# Altium schematic sheet 1_P1.schdoc
size 431 x 309 mm; Symbol: Sheet-Symbol_A4; Device: Sheet-Symbol_A4; @Page Name: P1; @Create Date: 2023-05-10; @Page Count: 1; @Page No: 1; @Project Name: 大创第一版1; @Schematic Name: 大创第一版; @Update Date: 2023-07-12; Company: 重庆邮电大学; Drawed: 陈亦杨; Page Size: A4; Reviewed: 2021212923陈亦杨; Version: V1.1
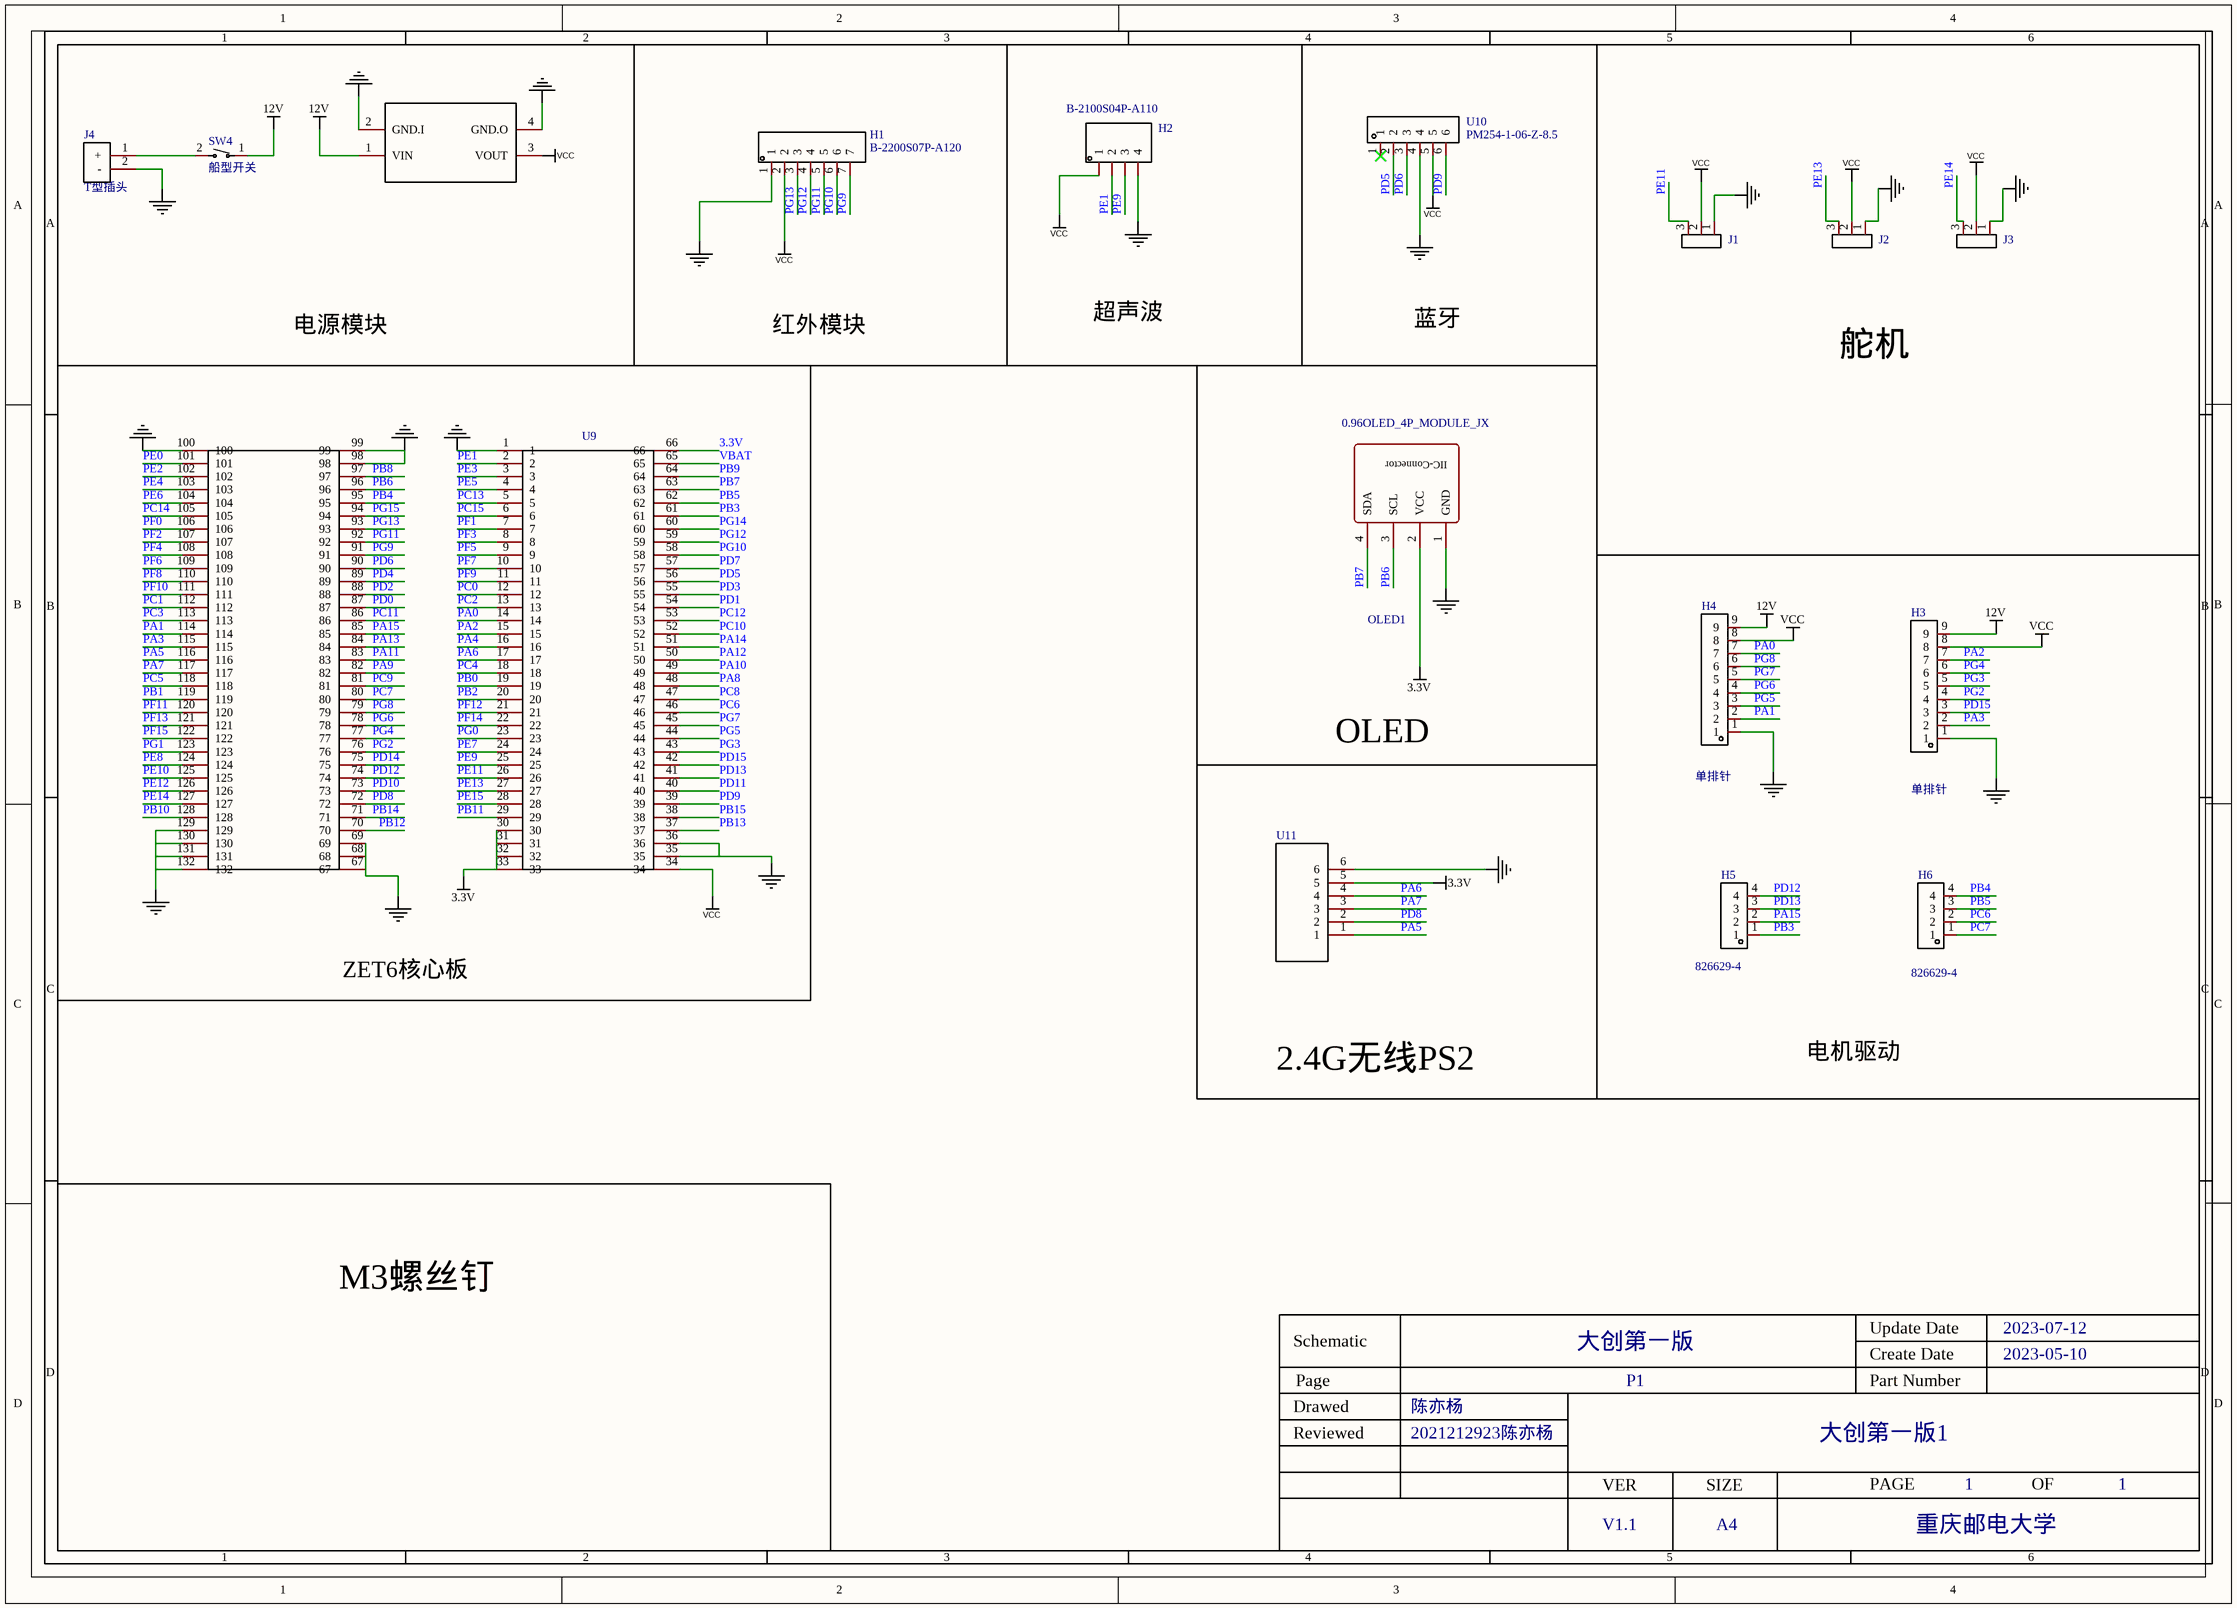
[diagram p0: 1_P1.schdoc]

## Parts
H1  B-2200S07P-A120  [HDR-TH_7P-P2.54-V-F]
H2  B-2100S04P-A110  [HDR-TH_4P-P2.54-V-M]
H3  单排针  [排针2.54MM9P]
H4  单排针  [排针2.54MM9P]
H5  826629-4  [HDR-TH_4P-P2.54-V-M-1]
H6  826629-4  [HDR-TH_4P-P2.54-V-M-1]
J1  3排针  [3排针]  (value not drawn)
J2  3排针  [3排针]  (value not drawn)
J3  3排针  [3排针]  (value not drawn)
J4  T型插头  [T型插头]
OLED1  0.96OLED_4P_MODULE_JX  [0.96OLED_4P]
SW4  船型开关  [SW-TH_MR1-110-C5N-BBAA]
U6  LM2596  [LM2596]  (value not drawn)
U9  ZET6核心板  [ZET6封装-2]  (value not drawn)
U10  PM254-1-06-Z-8.5  [HDR-TH_6P-P2.54-V-F]
U11  排针1*6  [排针1*6p]  (value not drawn)

## Nets
3.3V: OLED1.2(VCC) U9.30 U9.31 U9.32 U9.33 U9.66 U11.5
12V: H3.9 H4.9 SW4.1 U6.1(VIN)
GND: H1.1 H2.4 H3.1 H4.1 J1.1 J2.1 J3.1 J4.2(-) OLED1.1(GND) U6.2(GND.I) U6.4(GND.O) U9.1 U9.98 U9.99 U9.100 U10.4
NetU9_35: U9.35 U9.36 U9.67 U9.68 U9.69 U9.129 U9.130 U9.131 U9.132 U11.6
VCC: H1.2 H2.1 H3.8 H4.8 J1.2 J2.2 J3.2 U6.3(VOUT) U9.34 U10.5
PA0: H4.7 U9.14
PA1: H4.2 U9.114
PA2: H3.7 U9.15
PA3: H3.2 U9.115
PA4: U9.16
PA5: U9.116 U11.1
PA6: U9.17 U11.4
PA7: U9.117 U11.3
PA8: U9.48
PA9: U9.82
PA10: U9.49
PA11: U9.83
PA12: U9.50
PA13: U9.84
PA14: U9.51
PA15: H5.2 U9.85
PB0: U9.19
PB1: U9.119
PB2: U9.20
PB3: H5.1 U9.61
PB4: H6.4 U9.95
PB5: H6.3 U9.62
PB6: OLED1.3(SCL) U9.96
PB7: OLED1.4(SDA) U9.63
PB8: U9.97
PB9: U9.64
PB10: U9.128
PB11: U9.29
PB12: U9.70
PB13: U9.37
PB14: U9.71
PB15: U9.38
PC0: U9.12
PC1: U9.112
PC2: U9.13
PC3: U9.113
PC4: U9.18
PC5: U9.118
PC6: H6.2 U9.46
PC7: H6.1 U9.80
PC8: U9.47
PC9: U9.81
PC10: U9.52
PC11: U9.86
PC12: U9.53
PC13: U9.5
PC14: U9.105
PC15: U9.6
PD0: U9.87
PD1: U9.54
PD2: U9.88
PD3: U9.55
PD4: U9.89
PD5: U9.56 U10.2
PD6: U9.90 U10.3
PD7: U9.57
PD8: U9.72 U11.2
PD9: U9.39 U10.6
PD10: U9.73
PD11: U9.40
PD12: H5.4 U9.74
PD13: H5.3 U9.41
PD14: U9.75
PD15: H3.3 U9.42
PE0: U9.101
PE1: H2.2 U9.2
PE2: U9.102
PE3: U9.3
PE4: U9.103
PE5: U9.4
PE6: U9.104
PE7: U9.24
PE8: U9.124
PE9: H2.3 U9.25
PE10: U9.125
PE11: J1.3 U9.26
PE12: U9.126
PE13: J2.3 U9.27
PE14: J3.3 U9.127
PE15: U9.28
PF0: U9.106
PF1: U9.7
PF2: U9.107
PF3: U9.8
PF4: U9.108
PF5: U9.9
PF6: U9.109
PF7: U9.10
PF8: U9.110
PF9: U9.11
PF10: U9.111
PF11: U9.120
PF12: U9.21
PF13: U9.121
PF14: U9.22
PF15: U9.122
PG0: U9.23
PG1: U9.123
PG2: H3.4 U9.76
PG3: H3.5 U9.43
PG4: H3.6 U9.77
PG5: H4.3 U9.44
PG6: H4.4 U9.78
PG7: H4.5 U9.45
PG8: H4.6 U9.79
PG9: H1.7 U9.91
PG10: H1.6 U9.58
PG11: H1.5 U9.92
PG12: H1.4 U9.59
PG13: H1.3 U9.93
PG14: U9.60
PG15: U9.94
VBAT: U9.65
NetJ4_1: J4.1(+) SW4.2

Not connected (* = marked no-connect by the designer): U10 1*

## Notes on the sheet
- 超声波
- 电源模块
- 红外模块
- 蓝牙
- 舵机
- OLED
- ZET6核心板
- 2.4G无线PS2
- 电机驱动
- M3螺丝钉
- 1
- 2
- 3
- 4
- 5
- 6
- A
- B
- C
- D
- Schematic
- 大创第一版
- Create Date
- Update Date
- 2023-05-10
- 2023-07-12
- Reviewed
- Drawed
- Page
- 陈亦杨
- 2021212923陈亦杨
- P1
- Part Number
- 大创第一版1
- VER
- SIZE
- PAGE
- OF
- V1.1
- A4
- 重庆邮电大学
- (in symbol 0.96OLED_4P_MODULE_JX) IIC-Connector

## Library data of the parts
H1 = B-2200S07P-A120: 排数:单排;总孔位数:7;间距:2.54mm;插孔结构:1x7P;行距:-;安装类型:直插;塑高:-;触头材质:黄铜;触头镀层:-;; Manufacturer: Ckmtw(灿科盟); Symbol: 220S-1*7P H=8.5MM Ytype Gold-plated; Add into BOM: yes; Number of Holes: 7; Pitch: 2.54mm; Holes Structure: 1x7P; Name: B-2200S07P-A120; Device: B-2200S07P-A120; LCSC Part Name: 2.54mm1x7P; Supplier Part: C124418; Manufacturer Part: B-2200S07P-A120; Supplier Footprint: 直插,P=2.54mm; JLCPCB Part Class: ExtendedPart; Datasheet: https://atta.szlcsc.com/upload/public/pdf/source/20170821/C124418_1503303326113901572.pdf; Supplier: LCSC; Convert to PCB: yes; Number of Rows: 单排; Row Spacing: -; Mounting Type: 直插; Insulation Height: -; Contact Material: 黄铜; Contact Plating: -
H2 = B-2100S04P-A110: 排数:单排;总PIN位数:4;间距:2.54mm;插针结构:1x4P;行距:-;安装类型:直插;圆针/方针:-;额定电流:-;额定电压:-;配合针长度:6mm;塑高:2.54mm;端接针长度:3mm;触头材质:黄铜;触头镀层:-;工作温度范围:-40℃~+105℃;颜色:黑色;; Manufacturer: Ckmtw(灿科盟); Symbol: Header-Male-2.54_1x4; Add into BOM: yes; Pitch: 2.54mm; Pin Structure: 1x4P; Name: B-2100S04P-A110; Device: B-2100S04P-A110; LCSC Part Name: 2.54mm1x4P直插; Supplier Part: C124378; Manufacturer Part: B-2100S04P-A110; Supplier Footprint: 插件,P=2.54mm; JLCPCB Part Class: ExtendedPart; Datasheet: https://atta.szlcsc.com/upload/public/pdf/source/20170821/C124378_1503303307508901532.pdf; Supplier: LCSC; Convert to PCB: yes; Number of Rows: 单排; Number of Pins: 4; Row Spacing: -; Mounting Type: 直插; Circluar Pins/Square Pins: -; Current Rating (Max): -; Voltage Rating (Max): -; Length of Mating Pin: 6mm; Insulation Height: 2.54mm; Length of End Connection Pin: 3mm; Contact Material: 黄铜; Contact Plating: -; Operating Temperature Range: -40℃~+105℃; Color: 黑色
H3 H4 = 排针9P-2.54MM直插: Add into BOM: yes; Value: 0.0225; Name: 单排针; Symbol: 排针9P-2.54MM直插; Device: 排针9P-2.54MM直插; Supplier: 吉友; Convert to PCB: yes; Price: 0.045
H5 H6 = 排针2: 排数:单排;总PIN位数:4;间距:2.54mm;插针结构:1x4P;行距:-;安装类型:直插;圆针/方针:-;额定电流:-;额定电压:-;配合针长度:6.7mm;塑高:2.8mm;端接针长度:3.2mm;触头材质:-;工作温度范围:-;颜色:绿色;; Manufacturer: TE Connectivity(美国泰科); Add into BOM: yes; Pitch: 2.54mm; Pin Structure: 1x4P; Name: 826629-4; Symbol: 排针2; Device: 排针2; Convert to PCB: yes; LCSC Part Name: 2.54mm 1x4P 直插; Supplier Part: C590277; Manufacturer Part: 826629-4; Supplier Footprint: 插件,P=2.54mm; JLCPCB Part Class: 扩展库; Datasheet: https://atta.szlcsc.com/upload/public/pdf/source/20210923/FCC8CD9A04BA2624CF68C067B4A5B53A.pdf; Supplier: LCSC; Number of Rows: 单排; Number of Pins: 4; Row Spacing: -; Mounting Type: 直插; Circluar Pins/Square Pins: -; Current Rating (Max): -; Voltage Rating (Max): -; Length of Mating Pin: 6.7mm; Insulation Height: 2.8mm; Length of End Connection Pin: 3.2mm; Contact Material: -; Operating Temperature Range: -; Color: 绿色
J1-J3 = 3排针: Add into BOM: yes; Symbol: 3排针; Device: 3排针; Convert to PCB: yes
J4 = T型插头: Add into BOM: yes; _: 3; Name: T型插头; Symbol: T型插头; Device: T型插头; Convert to PCB: yes; Supplier: 逐飞科技
OLED1 = 0.96OLED_4P_MODULE_JX: Manufacturer: null; Add into BOM: yes; Name: 0.96OLED_4P_MODULE_JX; Symbol: 0.96OLED_4P_MODULE_JX; Device: 0.96OLED_4P_MODULE_JX; Convert to PCB: yes; 3DModel: 0.96OLED_4P; link: https://cn.bing.com/search?q=datasheet：0.96OLED; Supplier: LCSC; Supplier Part: C9900004566; Manufacturer Part: 0.96OLED_4P_MODULE_JX; JLCPCB Part Class: 扩展库
SW4 = MR1-110-C5N-BBAA: 额定电流:6A;额定电压(AC):250V;额定电压(DC):-;电路结构:单刀双掷;致动器类型:凹面弯曲;致动器颜色:黑色;致动器标志:O-;照明颜色:-;端接样式:焊片;开关功能:开-关;; Manufacturer: HONGJU(宏聚); Add into BOM: yes; Contact Current: 6A; Voltage Rating (AC): 250V; Circuit: 单刀双掷; Actuator Type: 凹面弯曲; Actuator Color: 黑色; Actuator Marking: O-; Switch Function: 开-关; Name: 船型开关; Symbol: MR1-110-C5N-BBAA; Device: MR1-110-C5N-BBAA; LCSC Part Name: 21*15开关ON-OFF6A250VAC; Supplier Part: C268221; Manufacturer Part: 船型开关; Supplier Footprint: ThroughHole; JLCPCB Part Class: ExtendedPart; Datasheet: https://atta.szlcsc.com/upload/public/pdf/source/20180906/C268221_8C71464C7CB1239118C227B6F3D265B4.pdf; Supplier: LCSC; Convert to PCB: yes; Voltage Rating (DC): -; Illumination Color: -; Termination Style: 焊片
U6 = LM2596: Add into BOM: yes; _: 3; Name: LM2596; Symbol: LM2596; Device: LM2596; Convert to PCB: yes
U9 = ZET6核心板: F103ZET6核心板; Symbol: ZET6; Convert to PCB: yes; Device: ZET6核心板; Add into BOM: yes
U10 = PM254-1-06-Z-8.5: 排数:单排;总孔位数:6;间距:2.54mm;插孔结构:1x6P;行距:-;安装类型:直插;圆孔/方孔:方孔;额定电流:3A;额定电压:-;插孔方向:顶部;塑高:8.5mm;工作温度范围:-40℃~+105℃;; Manufacturer: HCTL(华灿天禄); Add into BOM: yes; Number of Holes: 6; Pitch: 2.54mm; Holes Structure: 1x6P; Circular Hole / Square Hole: 方孔; Current Rating (Max): 3A; Holes Direction: 顶部; Name: PM254-1-06-Z-8.5; Symbol: PM254-1-06-Z-8.5; Device: PM254-1-06-Z-8.5; LCSC Part Name: 2.54mm1x6P; Supplier Part: C2897369; Manufacturer Part: PM254-1-06-Z-8.5; Supplier Footprint: 插件,P=2.54mm; JLCPCB Part Class: ExtendedPart; Datasheet: https://atta.szlcsc.com/upload/public/pdf/source/20210927/A587EC018F0ED68DBE3C69C90D2D513F.pdf; Supplier: LCSC; Convert to PCB: yes; Number of Rows: 单排; Row Spacing: -; Mounting Type: 直插; Voltage Rating (Max): -; Insulation Height: 8.5mm; Operating Temperature Range: -40℃~+105℃
U11 = 排针1*6: Add into BOM: yes; Symbol: 排针1*6; Device: 排针1*6; Convert to PCB: yes